# Altium project Poseidon.PrjPcb
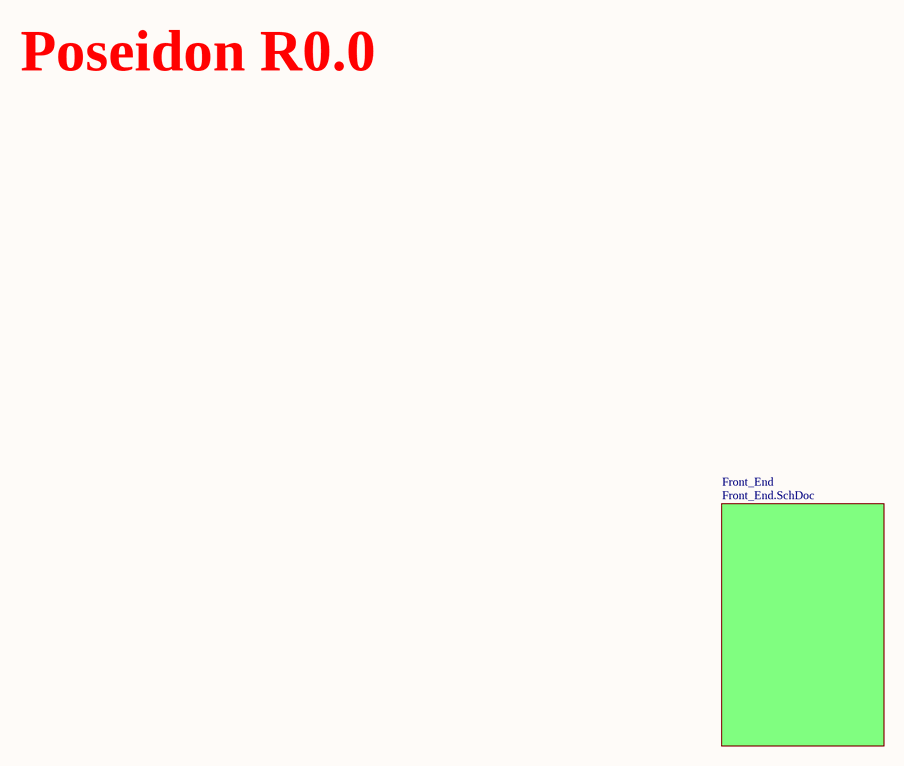
[diagram p0: TOP.SchDoc]
SCHtot: 2; Prj_Name: Poseidon; Prj_Date: 12/03/2024
2 sheets, 3 parts. Net scope: global (net labels, ports and power ports of the same name join across sheets).
Sheets:
  TOP.SchDoc
    Front_End = Front_End.SchDoc

## Sheet TOP.SchDoc: TOP
size A3; Author: SS; SheetNumber: 1; SheetTotal: 2

### Sub-sheets
Front_End = Front_End.SchDoc: no entries

### Notes on the sheet
- Poseidon R0.0
- Size:
- (...)
- A3
- Title:
- Sheet
- of
- Author:

## Sheet Front_End.SchDoc: Front_End
size A3; Author: SS; SheetNumber: 2; SheetTotal: 2
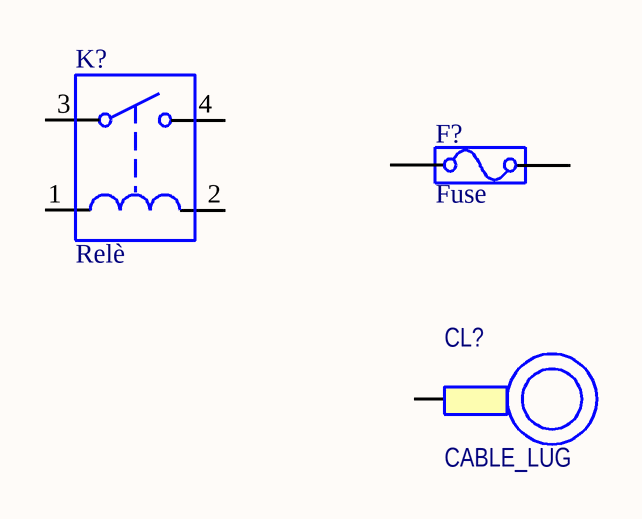
[diagram p1: Front_End.SchDoc]

### Parts
CL?  CABLE_LUG
F?  Fuse
K?  Relè

### Nets

Not connected (* = marked no-connect by the designer): CL? 1; F? 1 2; K? 1 2 3 4

### Notes on the sheet
- Size:
- (...)
- A3
- Title:
- Sheet
- of
- Author:

### Library data of the parts
CL? = CABLE_LUG: Capicorda Ring-Terminal; Value: CABLE_LUG
F? = FUSE_A: Fuse GP; Value: Fuse
K? = RELE_A: Relè GP; Value: Relè